# EAGLE design Universal Bicore (rev A) (EAGLE 6.4)
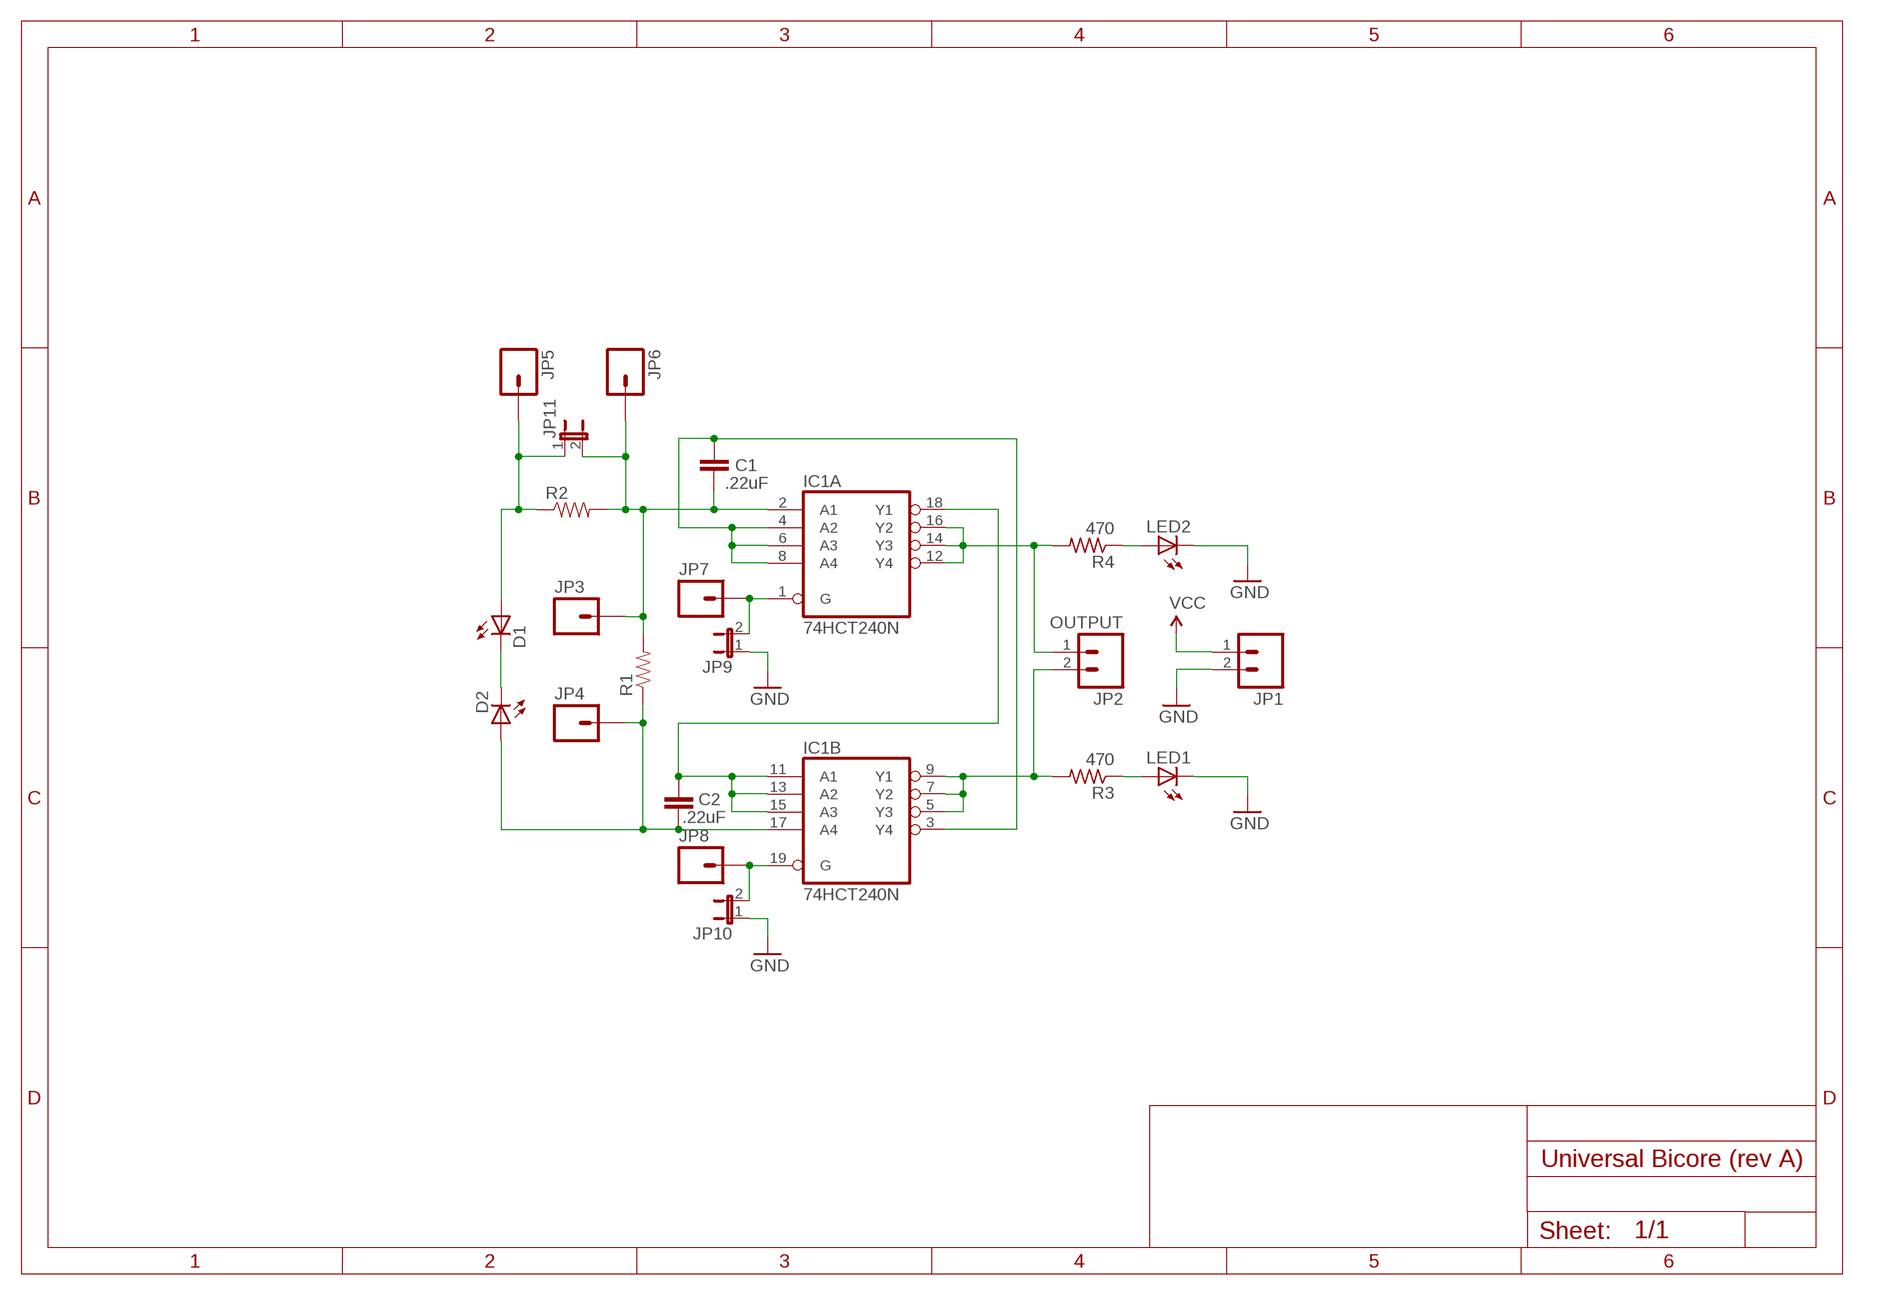
[diagram p0: schematic, sheet 1]

## Parts
C1  .22uF  CAPEZ  [CAP-PTH-SMALLEZ]
C2  .22uF  CAPEZ  [CAP-PTH-SMALLEZ]
D1  LED3MM  [LED3MM]
D2  LED3MM  [LED3MM]
IC1  74HCT240N  [DIL20]
JP1  M02PTH  [1X02]
JP2  OUTPUT  M02PTH  [1X02]
JP3  M01PTH  [1X01]
JP4  M01PTH  [1X01]
JP5  M01PTH  [1X01]
JP6  M01PTH  [1X01]
JP7  M01PTH  [1X01]
JP8  M01PTH  [1X01]
JP9  JUMPER-2SMD-NC  [SJ_2S]
JP10  JUMPER-2SMD-NC  [SJ_2S]
JP11  JUMPER-2SMD-NC  [SJ_2S]
LED1  LEDCHIPLED_0805  [CHIPLED_0805]
LED2  LEDCHIPLED_0805  [CHIPLED_0805]
R1  RESISTOREZ  [AXIAL-0.3EZ]
R2  RESISTOREZ  [AXIAL-0.3EZ]
R3  470  R-US_R0805  [R0805]
R4  470  R-US_R0805  [R0805]

## Nets
GND: JP1.2 JP9.1 JP10.1 LED1.C LED2.C
N$1: C1.1 IC1.2(A:A1) JP3.1 JP6.1 JP11.2 R1.P$2 R2.P$2
N$2: C1.2 IC1.3(B:Y4) IC1.4(A:A2) IC1.6(A:A3) IC1.8(A:A4)
N$3: IC1.12(A:Y4) IC1.14(A:Y3) IC1.16(A:Y2) JP2.1 R4.2
N$4: C2.1 IC1.11(B:A1) IC1.13(B:A2) IC1.15(B:A3) IC1.18(A:Y1)
N$5: C2.2 D2.A IC1.17(B:A4) JP4.1 R1.P$1
N$6: IC1.5(B:Y3) IC1.7(B:Y2) IC1.9(B:Y1) JP2.2 R3.2
N$7: D1.A JP5.1 JP11.1 R2.P$1
N$8: D1.K(C) D2.K(C)
N$9: LED2.A R4.1
N$10: LED1.A R3.1
N$11: IC1.1(A:G) JP7.1 JP9.2
N$12: IC1.19(B:G) JP8.1 JP10.2
VCC: JP1.1

## Power pins joined to a net without a drawn wire
GND: IC1.10(P:GND)
VCC: IC1.20(P:VCC)

## Library data of the parts
C1 C2 = SparkFun-Capacitors:CAP: Capacitor Standard 0603 ceramic capacitor, and 0.1" leaded capacitor.
D1 D2 LED1 LED2 = led:LED: LED OSRAM: - CHIPLED LG R971, LG N971, LY N971, LG Q971, LY Q971, LO R971, LY R971 LH N974, LH R974 LS Q976, LO Q976, LY Q976 LO Q996 - Hyper CHIPLED LW Q18S LB Q993, LB Q99A, LB R99A - SideLED LS A670, LO A670, LY A670, LG A670, LP A670 LB A673, LV A673, LT A673, LW A673 LH A674 LY A675 LS A676, LA A676, LO A676, LY A676, LW A676 LS A679, LY A679, LG A679 - Hyper Micro SIDELED® LS Y876, LA Y876, LO Y876, LY Y876 LT Y87S - SmartLED LW L88C, LW L88S LB L89C, LB L89S, LG L890 LS L89K, LO L89K, LY L89K LS L896, LA L896, LO L896, LY L896 - TOPLED LS T670, LO T670, LY T670, LG T670, LP T670 LSG T670, LSP T670, LSY T670, LOP T670, LYG T670 LG T671, LOG T671, LSG T671 LB T673, LV T673, LT T673, LW T673 LH T674 LS T676, LA T676, LO T676, LY T676, LB T676, LH T676, LSB T676, LW T676 LB T67C, LV T67C, LT T67C, LS T67K, LO T67K, LY T67K, LW E67C LS E67B, LA E67B, LO E67B, LY E67B, LB E67C, LV E67C, LT E67C LW T67C LS T679, LY T679, LG T679 LS T770, LO T770, LY T770, LG T770, LP T770 LB T773, LV T773, LT T773, LW T773 LH T774 LS E675, LA E675, LY E675, LS T675 LS T776, LA T776, LO T776, LY T776, LB T776 LHGB T686 LT T68C, LB T68C - Hyper Mini TOPLED® LB M676 - Mini TOPLED Santana® LG M470 LS M47K, LO M47K, LY M47K Source: http://www.osram.convergy.de LUXEON: - LUMILED® LXK2-PW12-R00, LXK2-PW12-S00, LXK2-PW14-U00, LXK2-PW14-V00 LXK2-PM12-R00, LXK2-PM12-S00, LXK2-PM14-U00 LXK2-PE12-Q00, LXK2-PE12-R00, LXK2-PE12-S00, LXK2-PE14-T00, LXK2-PE14-U00 LXK2-PB12-K00, LXK2-PB12-L00, LXK2-PB12-M00, LXK2-PB14-N00, LXK2-PB14-P00, LXK2-PB14-Q00 LXK2-PR12-L00, LXK2-PR12-M00, LXK2-PR14-Q00, LXK2-PR14-R00 LXK2-PD12-Q00, LXK2-PD12-R00, LXK2-PD12-S00 LXK2-PH12-R00, LXK2-PH12-S00 LXK2-PL12-P00, LXK2-PL12-Q00, LXK2-PL12-R00 Source: www.luxeon.com KINGBRIGHT: KA-3528ASYC Source: www.kingbright.com
IC1 = 74xx-eu:74*240: Octal BUFFER and LINE DRIVER, 3-state
JP1 JP2 = SparkFun-Connectors:M02: Header 2 Standard 2-pin 0.1" header. Use with straight break away headers (SKU : PRT-00116), right angle break away headers (PRT-00553), swiss pins (PRT-00743), machine pins (PRT-00117), and female headers (PRT-00115). Molex polarized connector foot print use with SKU : PRT-08233 with associated crimp pins and housings.
JP3-JP8 = SparkFun-Connectors:M01: Header 1 Standard 1-pin 0.1" header. Use with straight break away headers (SKU : PRT-00116), right angle break away headers (PRT-00553), swiss pins (PRT-00743), machine pins (PRT-00117), and female headers (PRT-00115).
JP9-JP11 = SparkFun-Passives:JUMPER-2: Jumper Basic 0.1" spaced jumper. Use with breakaway headers.
R1 R2 = SparkFun-Resistors:RESISTOR: Resistor Basic schematic elements and footprints for 0603, 1206, and PTH resistors.
R3 R4 = resistor:R-US_: RESISTOR, American symbol

## Board
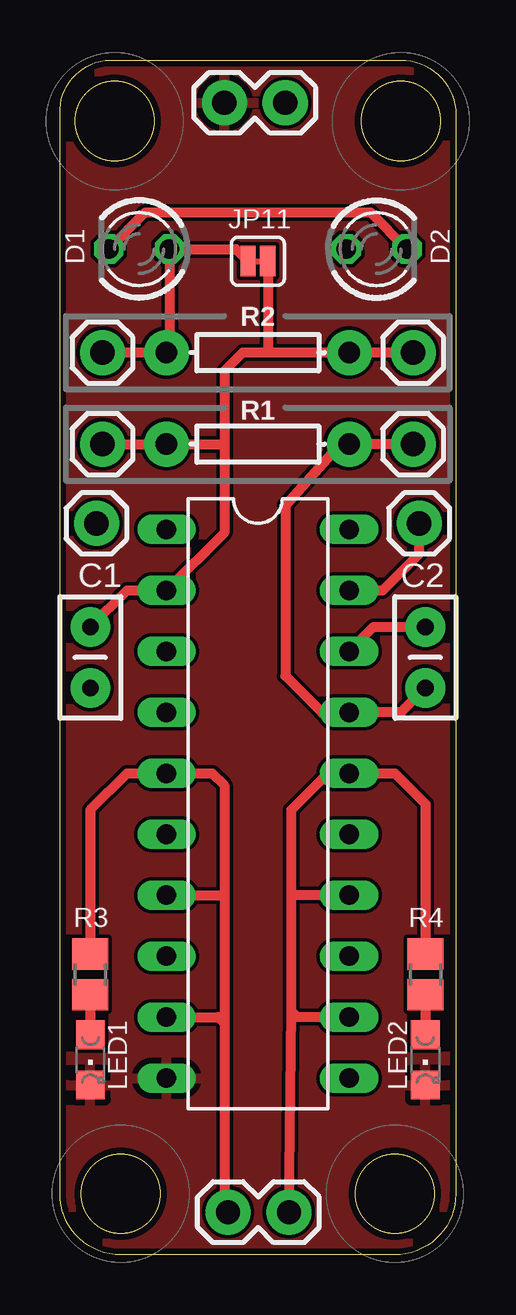
[diagram p1: board, top side]
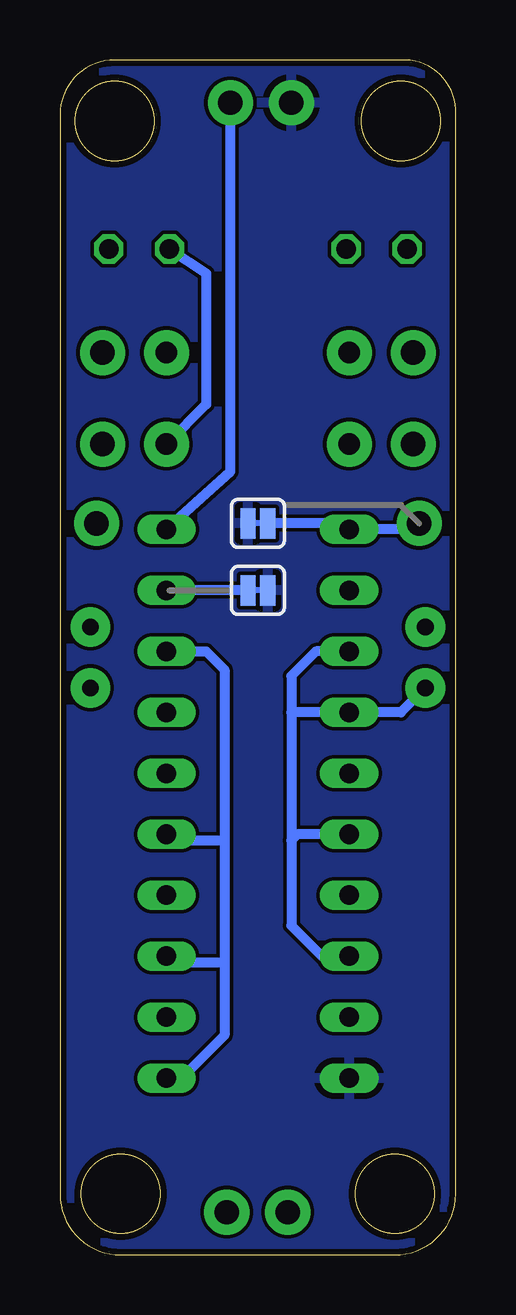
[diagram p2: board, bottom side, seen from below]

Size 16.51 x 49.79 mm. Coordinates in mm from the lower left corner, seen from the top.
Outline: 0,47.75 arc-90 2.29,49.78 14.22,49.78 arc-90 16.51,47.5 16.51,2.54 arc-90 13.97,0 2.54,0 arc-90 0,2.54 0,47.75
Outline: circle at 2.54,2.54 radius 1.65
Outline: circle at 13.97,2.54 radius 1.65
Outline: circle at 14.22,47.24 radius 1.65
Outline: circle at 2.29,47.24 radius 1.65
Copper layers (1*2*15*16): Top 0.035mm / dielectric 0.2mm / layer 2 0.0175mm / dielectric 1.1mm / layer 15 0.0175mm / dielectric 0.2mm / Bottom 0.035mm
Design rules "SeeedStudio_DRU_no_angle_20130527": minimum track width 6mil, minimum drill 12mil, track to track 6mil, track to pad 6mil, pad to pad 6mil, via to via 6mil, smd to smd 0mil, copper to edge 10mil, drill to drill 10mil, minimum pad ring 6mil, minimum via ring 6mil, stop-mask expansion 2mil, vias tented up to drill 25mil, thermal gap 10mil

### Footprints (pad centres in the part's own frame; a part is rotated, then mirrored left to right if it is on the bottom)
CAP-PTH-SMALLEZ = drill 0.7 pad 1.651: 1 0,0; 2 2.54,0
LED3MM = drill 0.813 octagon: A -1.27,0; K 1.27,0
DIL20 = drill 0.813 long: 1 -11.43,-3.81; 2 -8.89,-3.81; 3 -6.35,-3.81; 4 -3.81,-3.81; 5 -1.27,-3.81; 6 1.27,-3.81; 7 3.81,-3.81; 8 6.35,-3.81; 9 8.89,-3.81; 10 11.43,-3.81; 11 11.43,3.81; 12 8.89,3.81; 13 6.35,3.81; 14 3.81,3.81; 15 1.27,3.81; 16 -1.27,3.81; 17 -3.81,3.81; 18 -6.35,3.81; 19 -8.89,3.81; 20 -11.43,3.81
1X02 = drill 1.016 pad 1.88: 1 0,0; 2 2.54,0
1X01 = drill 1.016 pad 1.88: 1 0,0
SJ_2S = smd 0.635 x 1.27: 1 -0.412,0; 2 0.412,0
CHIPLED_0805 = smd 1.2 x 1.2: A 0,-1.05; C 0,1.05
AXIAL-0.3EZ = drill 0.9 pad 1.88: P$1 -3.81,0; P$2 3.81,0
R0805 = smd 1.3 x 1.5: 1 -0.85,0; 2 0.85,0

### Placement (x,y rotation side)
C1  1.27,26.16 270 top
C2  15.24,26.16 270 top
D1  3.3,41.91 180 top
D2  13.21,41.91 0 top
IC1  8.26,18.8 270 top
JP1  9.4,48.01 180 top
JP2  9.55,1.78 180 top
JP3  1.78,33.78 0 top
JP4  14.73,33.78 0 top
JP5  1.78,37.59 0 top
JP6  14.73,37.59 90 top
JP7  1.52,30.48 0 top
JP8  14.99,30.48 90 top
JP9  8.26,30.48 0 bottom
JP10  8.26,27.69 180 bottom
JP11  8.26,41.4 0 top
LED1  1.27,8.13 180 top
LED2  15.24,8.13 180 top
R1  8.26,33.78 180 top
R2  8.26,37.59 0 top
R3  1.27,11.68 90 top
R4  15.24,11.68 90 top

### Tracks (layer width: path | path; a pad name or v marks a point on that pad's centre or on a via)
GND
  pour Top: -0.51,-0.51 17.02,-0.51 17.02,50.29 -0.51,50.29
  pour Bottom: -0.51,-0.51 17.02,-0.51 17.02,50.29 -0.51,50.29
N$1
  Top 0.406: JP6.1 R2.P$2 8.64,37.59 | JP3.1 R1.P$2 6.86,33.78 | C1.1 2.79,27.69 IC1.2 6.86,30.1 6.86,33.78 | 8.64,37.59 7.62,37.59 6.86,36.83 6.86,33.78 | JP11.2 8.67,37.62 8.64,37.59
N$2
  Bottom 0.406: 6.86,22.61 6.86,24.13 5.84,25.15 IC1.3 | 6.86,22.61 6.86,17.27 | 6.86,17.27 6.86,13.72 5.59,12.45 IC1.8 | IC1.6 6.6,17.53 6.86,17.27 | 6.86,22.61 IC1.4 2.29,22.61 C1.2
N$3
  Top 0.406: JP2.1 9.65,10.16 | 9.65,10.16 9.65,14.99 | 9.65,14.99 9.65,18.54 10.92,19.81 11.81,19.81 IC1.16 13.97,20.07 15.24,18.8 R4.2 | IC1.14 9.65,14.99 | IC1.12 9.91,9.91 9.65,10.16
N$4
  Top 0.406: IC1.18 13.08,26.16 C2.1
  Bottom 0.406: IC1.18 10.41,25.15 9.65,24.38 9.65,17.27 | 9.65,17.27 9.65,12.19 | 9.65,12.19 9.65,9.14 11.43,7.37 IC1.11 | IC1.13 11.81,12.19 9.65,12.19 | IC1.15 11.81,17.27 9.65,17.27
N$5
  Top 0.406: JP4.1 R1.P$1 11.68,33.78 9.4,31.24 9.4,24.13 10.92,22.61 IC1.17 14.22,22.61 C2.2
  Bottom 0.406: D2.A 10.41,40.89 10.41,35.43 R1.P$1
N$6
  Top 0.406: 6.86,14.99 6.86,19.56 6.35,20.07 IC1.5 2.79,20.07 1.27,18.54 R3.2 | 6.86,14.99 6.86,9.65 | 6.86,9.65 6.86,2.03 JP2.2 | 6.86,9.65 6.6,9.91 IC1.9 | IC1.7 6.86,14.99
N$7
  Top 0.406: JP5.1 R2.P$1 4.57,37.72 D1.A 7.33,41.91 JP11.1
N$8
  Top 0.406: D1.K 3.56,43.43 12.95,43.43 D2.K
N$9
  Top 0.406: R4.1 LED2.A
N$10
  Top 0.406: R3.1 LED1.A
N$11
  Bottom 0.406: JP7.1 1.78,30.23 IC1.1 4.7,30.48 JP9.2
N$12
  Top 0.406: IC1.19 13.46,27.69 14.99,29.21 JP8.1
  Bottom 0.406: JP10.2 IC1.19
N$13
  Bottom 0.254: 7.87,30.48 8.64,30.48
N$14
  Bottom 0.254: 7.87,27.69 8.64,27.69
N$15
  Top 0.254: 8.13,41.4 8.38,41.4
VCC
  Bottom 0.406: IC1.20 9.4,32.64 JP1.1

### Text on the board
tDocu: - | + | POWER | RIGHT | LEFT | L | R
bDocu: - | + | rev A | EO1 | EO2 | UNIVERSAL BICORE | http://jason-webb.info | Designed by Jason Webb